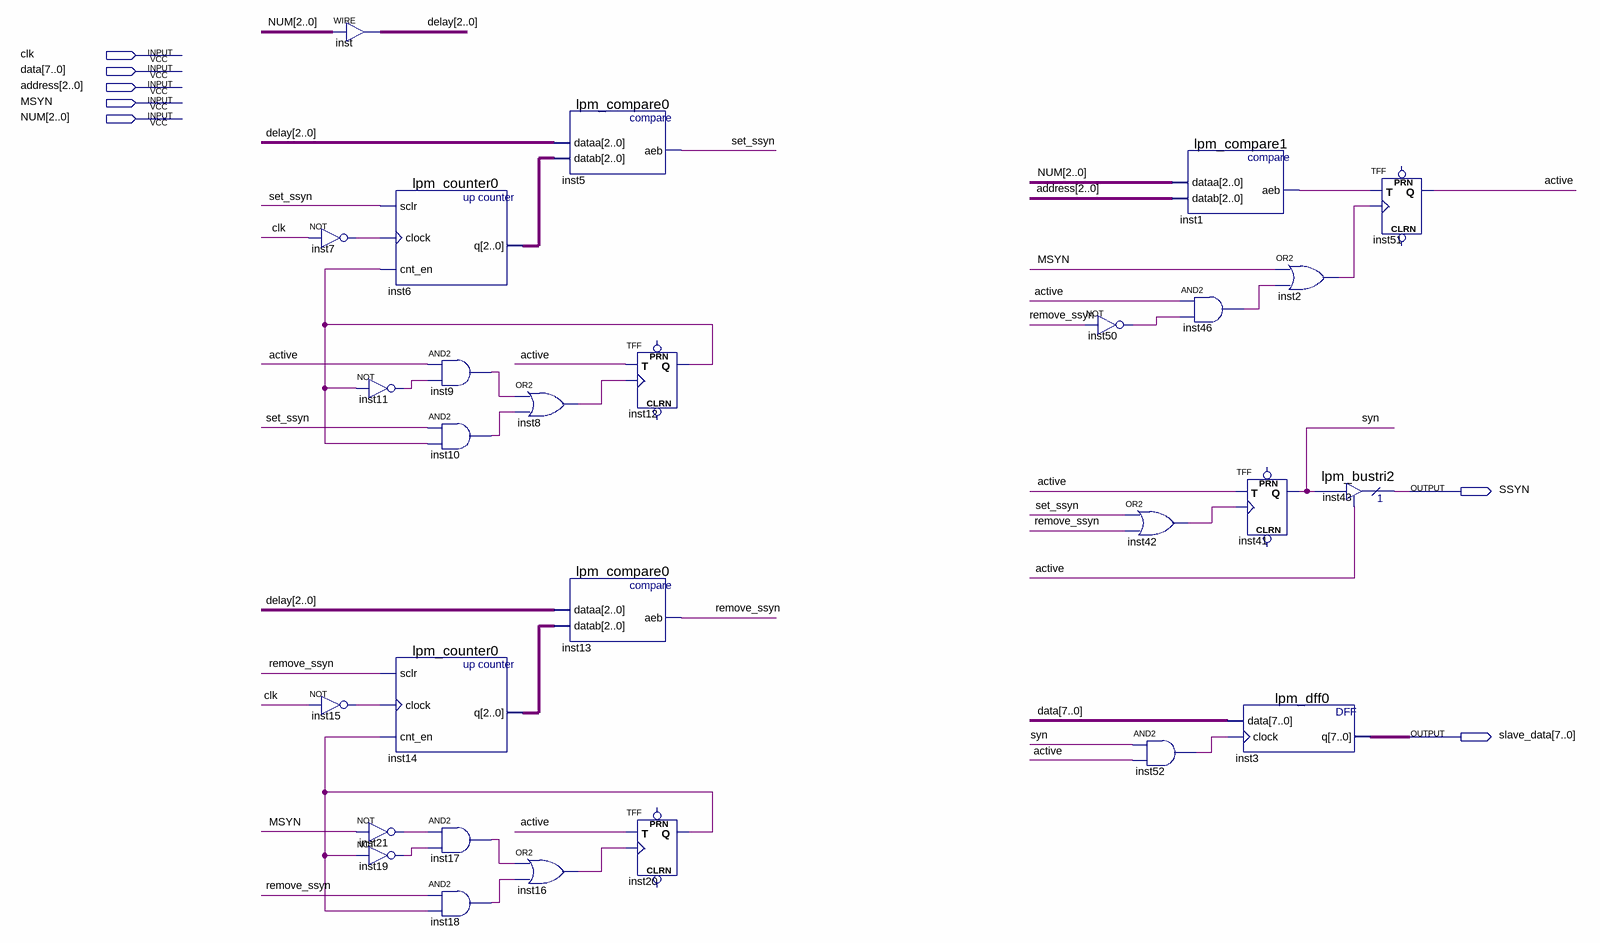
[diagram p0: schematic sheet]
// Quartus schematic slave.bdf as structural Verilog: 28 symbols, 7 pins
module slave (
  input  clk,
  input  [7:0] data,
  input  [2:0] address,
  input  MSYN,
  input  [2:0] NUM,
  output SSYN,
  output [7:0] slave_data
);

  wire active, inst1_aeb, inst2_out, inst7_out, inst8_out, inst9_out, inst10_out, inst11_out, inst12_q,
       inst15_out, inst16_out, inst17_out, inst18_out, inst19_out, inst20_q, inst21_out, inst42_out,
       inst46_out, inst50_out, inst52_out, remove_ssyn, set_ssyn, syn;
  wire [2:0] delay, inst6_q, inst14_q;

  assign delay = NUM;  // WIRE inst
  not inst7 (inst7_out, clk);
  not inst11 (inst11_out, inst12_q);
  not inst15 (inst15_out, clk);
  not inst21 (inst21_out, MSYN);
  not inst19 (inst19_out, inst20_q);
  lpm_counter0 inst6 (.sclr(set_ssyn), .clock(inst7_out), .cnt_en(inst12_q), .q(inst6_q));
  lpm_counter0 inst14 (.sclr(remove_ssyn), .clock(inst15_out), .cnt_en(inst20_q), .q(inst14_q));
  and inst9 (inst9_out, active, inst11_out);
  and inst10 (inst10_out, set_ssyn, inst12_q);
  and inst17 (inst17_out, inst21_out, inst19_out);
  and inst18 (inst18_out, remove_ssyn, inst20_q);
  or inst8 (inst8_out, inst9_out, inst10_out);
  or inst16 (inst16_out, inst17_out, inst18_out);
  lpm_compare0 inst5 (.dataa(delay), .datab(inst6_q), .aeb(set_ssyn));
  lpm_compare0 inst13 (.dataa(delay), .datab(inst14_q), .aeb(remove_ssyn));
  TFF inst12 (.T(active), .CLK(inst8_out), .Q(inst12_q));  // open: PRN, CLRN
  TFF inst20 (.T(active), .CLK(inst16_out), .Q(inst20_q));  // open: PRN, CLRN
  not inst50 (inst50_out, remove_ssyn);
  lpm_compare1 inst1 (.dataa(NUM), .datab(address), .aeb(inst1_aeb));
  and inst46 (inst46_out, active, inst50_out);
  or inst42 (inst42_out, set_ssyn, remove_ssyn);
  and inst52 (inst52_out, syn, active);
  TFF inst41 (.T(active), .CLK(inst42_out), .Q(syn));  // open: PRN, CLRN
  lpm_dff0 inst3 (.data(data), .clock(inst52_out), .q(slave_data));
  or inst2 (inst2_out, MSYN, inst46_out);
  TFF inst51 (.T(inst1_aeb), .CLK(inst2_out), .Q(active));  // open: PRN, CLRN
  lpm_bustri2 inst43 (.enabledt(active), .data(syn), .tridata(SSYN));
endmodule
